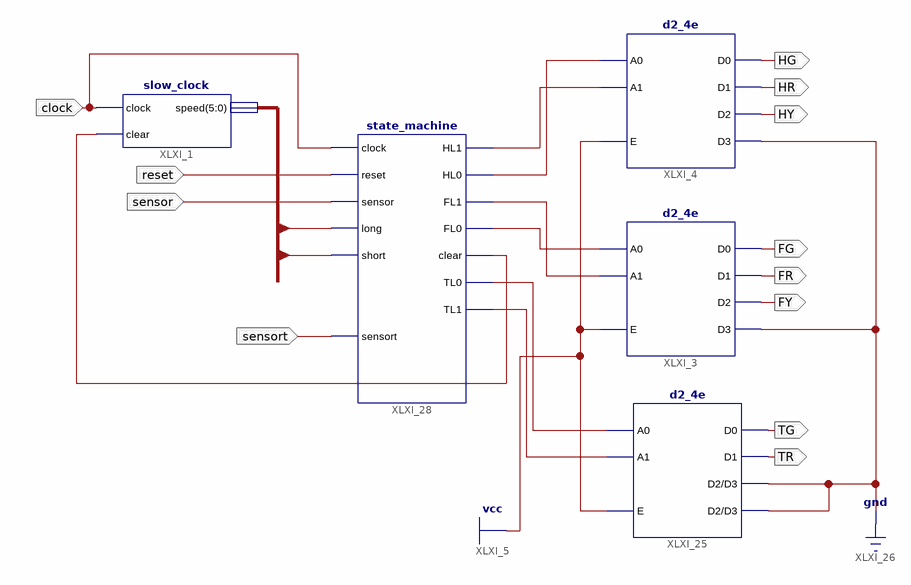
[diagram p0: schematic sheet 1]
// Xilinx ISE schematic top.sch (spartan6) as structural Verilog: 5 symbols, 12 ports
module top (
  input  sensor,
  input  reset,
  input  clock,
  input  sensort,
  output FY,
  output FR,
  output FG,
  output HY,
  output HR,
  output HG,
  output TG,
  output TR
);

  wire XLXN_2, XLXN_3, XLXN_4, XLXN_5, XLXN_7, XLXN_43, XLXN_44;
  wire [5:0] speed;

  slow_clock XLXI_1 (.clock(clock), .clear(XLXN_7), .speed(speed));
  d2_4e XLXI_3 (.A0(XLXN_5), .A1(XLXN_4), .E(1'b1), .D0(FG), .D1(FR), .D2(FY), .D3(1'b0));
  d2_4e XLXI_4 (.A0(XLXN_2), .A1(XLXN_3), .E(1'b1), .D0(HG), .D1(HR), .D2(HY), .D3(1'b0));
  d2_4e XLXI_25 (.A0(XLXN_43), .A1(XLXN_44), .E(1'b1), .D0(TG), .D1(TR), .D2(1'b0), .D3(1'b0));
  state_machine XLXI_28 (
    .clock(clock), .reset(reset), .sensor(sensor), .sensort(sensort), .long(speed[5]), .short(speed[3]),
    .HL1(XLXN_3), .HL0(XLXN_2), .FL1(XLXN_4), .FL0(XLXN_5), .TL0(XLXN_43), .TL1(XLXN_44), .clear(XLXN_7));
endmodule
